# Altium schematic sheet [04]-PYTHON_FPGA_INTERFACE.SchDoc
size A4
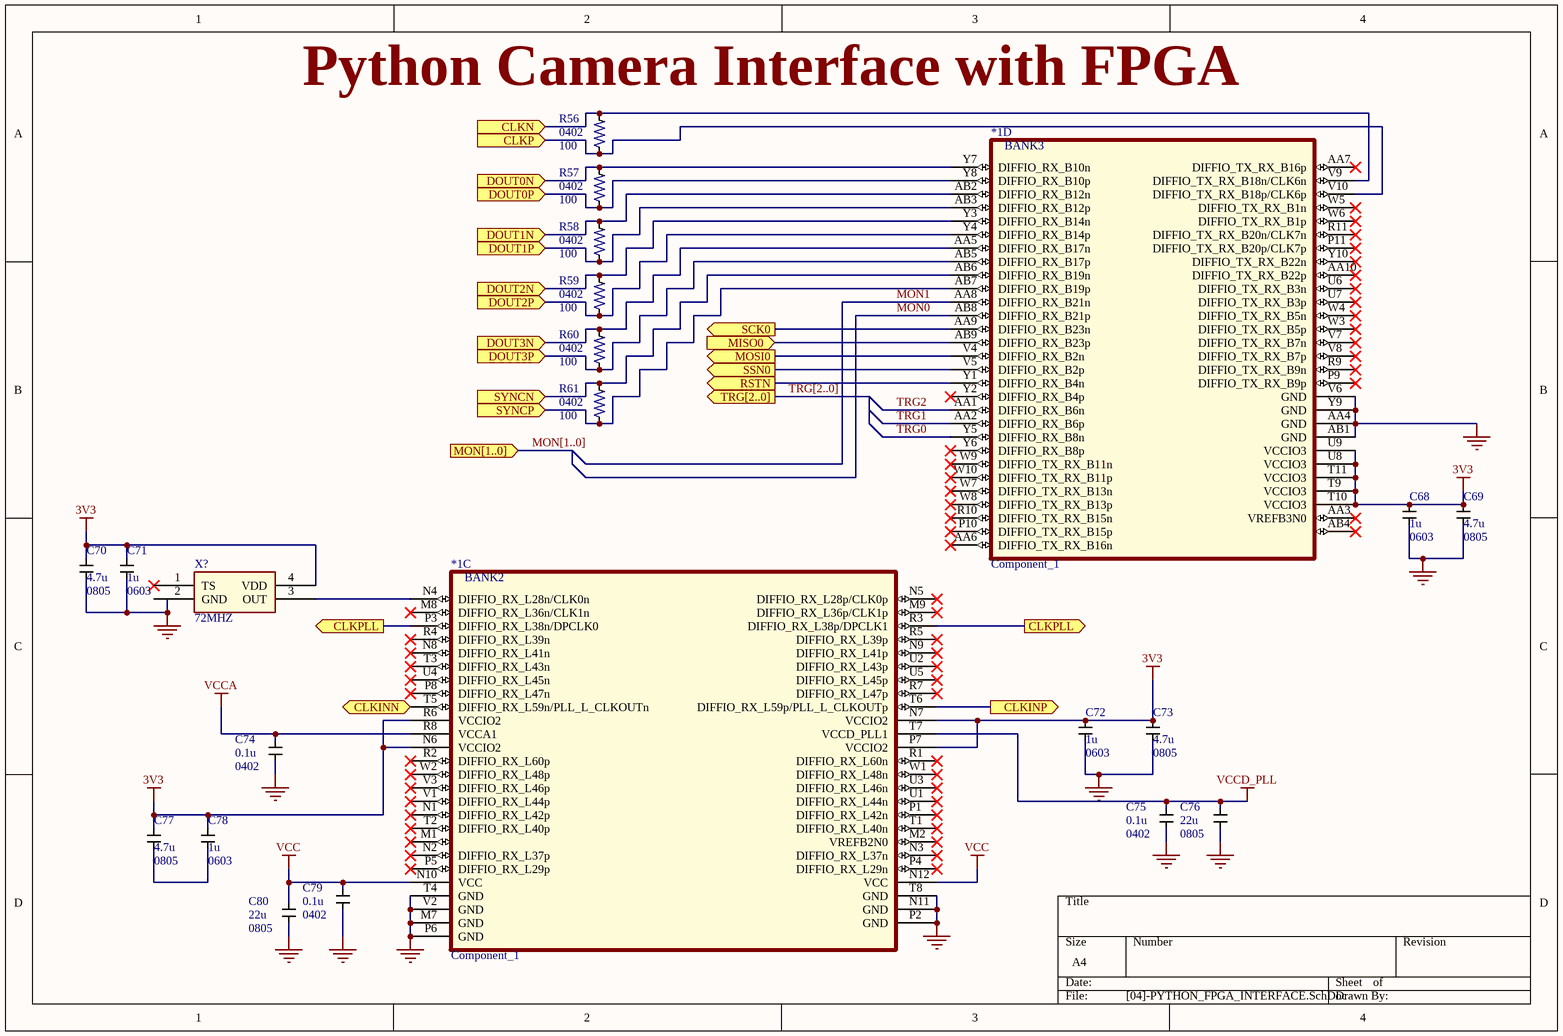
[diagram p0: [04]-PYTHON_FPGA_INTERFACE.SchDoc]

## Parts
*1  Component_1  [*BGA484N100P22X22_2300X2300X350]  (parts C,D of 9)
C68  1u  PCB Layer:: 0603  [*0603]
C69  4.7u  PCB Package: 0805  [*CAPC2013X140N]
C70  4.7u  PCB Package: 0805  [*CAPC2013X140N]
C71  1u  PCB Layer:: 0603  [*0603]
C72  1u  PCB Layer:: 0603  [*0603]
C73  4.7u  PCB Package: 0805  [*CAPC2013X140N]
C74  0.1u  PCB footprint: 0402
C75  0.1u  PCB footprint: 0402
C76  22u  PCB footprint: 0805
C77  4.7u  PCB Package: 0805  [*CAPC2013X140N]
C78  1u  PCB Layer:: 0603  [*0603]
C79  0.1u  PCB footprint: 0402
C80  22u  PCB footprint: 0805
R56  100  foot print: 0402  [*RESC1608X50N]
R57  100  foot print: 0402  [*RESC1608X50N]
R58  100  foot print: 0402  [*RESC1608X50N]
R59  100  foot print: 0402  [*RESC1608X50N]
R60  100  foot print: 0402  [*RESC1608X50N]
R61  100  foot print: 0402  [*RESC1608X50N]
X?  72MHZ  [OSC_DSC6083CI2A-032K768]

## Ports
CLKINN (out), CLKINP (out), CLKN (in), CLKP (in), CLKPLL (out), DOUT0N (in), DOUT0P (in), DOUT1N (in), DOUT1P (in), DOUT2N (in), DOUT2P (in), DOUT3N (in), DOUT3P (in), MISO0 (in), MON[1..0] (in), MOSI0 (out), RSTN (out), SCK0 (out), SSN0 (out), SYNCN (in), SYNCP (in), TRG[2..0] (out)

## Nets
3V3: *1.N6(VCCIO2) *1.N7(VCCIO2) *1.P7(VCCIO2) *1.R6(VCCIO2) *1.T9(VCCIO3) *1.T10(VCCIO3) *1.T11(VCCIO3) *1.U8(VCCIO3) *1.U9(VCCIO3) C68.2 C69.2 C70.2 C71.2 C72.2 C73.2 C77.2 C78.2 X?.4(VDD)
GND: *1.AA4(GND) *1.AB1(GND) *1.M7(GND) *1.N11(GND) *1.P2(GND) *1.P6(GND) *1.T4(GND) *1.T8(GND) *1.V2(GND) *1.V6(GND) *1.Y9(GND) C68.1 C69.1 C70.1 C71.1 C72.1 C73.1 C74.1 C75.1 C76.1 C79.1 C80.1 X?.2(GND)
VCC: *1.N10(VCC) *1.N12(VCC) C79.2 C80.2
VCCA: *1.R8(VCCA1) C74.2
VCCD_PLL: *1.T7(VCCD_PLL1) C75.2 C76.2
CLKINN: *1.T5(DIFFIO_RX_L59n/PLL_L_CLKOUTn) ; port CLKINN
CLKINP: *1.T6(DIFFIO_RX_L59p/PLL_L_CLKOUTp) ; port CLKINP
CLKN: *1.V9(DIFFIO_TX_RX_B18n/CLK6n) R56.2 ; port CLKN
CLKP: *1.V10(DIFFIO_TX_RX_B18p/CLK6p) R56.1 ; port CLKP
CLKPLL: *1.P3(DIFFIO_RX_L38n/DPCLK0) *1.R3(DIFFIO_RX_L38p/DPCLK1) ; port CLKPLL
DOUT0N: *1.Y7(DIFFIO_RX_B10n) R57.2 ; port DOUT0N
DOUT0P: *1.Y8(DIFFIO_RX_B10p) R57.1 ; port DOUT0P
DOUT1N: *1.AB2(DIFFIO_RX_B12n) R58.2 ; port DOUT1N
DOUT1P: *1.AB3(DIFFIO_RX_B12p) R58.1 ; port DOUT1P
DOUT2N: *1.Y3(DIFFIO_RX_B14n) R59.2 ; port DOUT2N
DOUT2P: *1.Y4(DIFFIO_RX_B14p) R59.1 ; port DOUT2P
DOUT3N: *1.AA5(DIFFIO_RX_B17n) R60.2 ; port DOUT3N
DOUT3P: *1.AB5(DIFFIO_RX_B17p) R60.1 ; port DOUT3P
MISO0: *1.AB9(DIFFIO_RX_B23p) ; port MISO0
MON0: *1.AB8(DIFFIO_RX_B21p)
MON1: *1.AA8(DIFFIO_RX_B21n)
MOSI0: *1.V4(DIFFIO_RX_B2n) ; port MOSI0
RSTN: *1.Y1(DIFFIO_RX_B4n) ; port RSTN
SCK0: *1.AA9(DIFFIO_RX_B23n) ; port SCK0
SSN0: *1.V5(DIFFIO_RX_B2p) ; port SSN0
SYNCN: *1.AB6(DIFFIO_RX_B19n) R61.2 ; port SYNCN
SYNCP: *1.AB7(DIFFIO_RX_B19p) R61.1 ; port SYNCP
TRG0: *1.Y5(DIFFIO_RX_B8n)
TRG1: *1.AA2(DIFFIO_RX_B6p)
TRG2: *1.AA1(DIFFIO_RX_B6n)
Net*1_N4: *1.N4(DIFFIO_RX_L28n/CLK0n) X?.3(OUT)
NetC77_1: C77.1 C78.1

Not connected (* = marked no-connect by the designer): *1 AA3(VREFB3N0)* AA6(DIFFIO_TX_RX_B16n)* AA7(DIFFIO_TX_RX_B16p)* AA10(DIFFIO_TX_RX_B22p)* AB4* M1* M2(VREFB2N0)* M8(DIFFIO_RX_L36n/CLK1n)* M9(DIFFIO_RX_L36p/CLK1p)* N1(DIFFIO_RX_L42p)* N2(DIFFIO_RX_L37p)* N3(DIFFIO_RX_L37n)* N5(DIFFIO_RX_L28p/CLK0p)* N8(DIFFIO_RX_L41n)* N9(DIFFIO_RX_L41p)* P1(DIFFIO_RX_L42n)* P4(DIFFIO_RX_L29n)* P5(DIFFIO_RX_L29p)* P8(DIFFIO_RX_L47n)* P9(DIFFIO_TX_RX_B9p)* P10(DIFFIO_TX_RX_B15p)* P11(DIFFIO_TX_RX_B20p/CLK7p)* R1(DIFFIO_RX_L60n)* R2(DIFFIO_RX_L60p)* R4(DIFFIO_RX_L39n)* R5(DIFFIO_RX_L39p)* R7(DIFFIO_RX_L47p)* R9(DIFFIO_TX_RX_B9n)* R10(DIFFIO_TX_RX_B15n)* R11(DIFFIO_TX_RX_B20n/CLK7n)* T1(DIFFIO_RX_L40n)* T2(DIFFIO_RX_L40p)* T3(DIFFIO_RX_L43n)* U1(DIFFIO_RX_L44n)* U2(DIFFIO_RX_L43p)* U3(DIFFIO_RX_L46n)* U4(DIFFIO_RX_L45n)* U5(DIFFIO_RX_L45p)* U6(DIFFIO_TX_RX_B3n)* U7(DIFFIO_TX_RX_B3p)* V1(DIFFIO_RX_L44p)* V3(DIFFIO_RX_L46p)* V7(DIFFIO_TX_RX_B7n)* V8(DIFFIO_TX_RX_B7p)* W1(DIFFIO_RX_L48n)* W2(DIFFIO_RX_L48p)* W3(DIFFIO_TX_RX_B5p)* W4(DIFFIO_TX_RX_B5n)* W5(DIFFIO_TX_RX_B1n)* W6(DIFFIO_TX_RX_B1p)* W7(DIFFIO_TX_RX_B13n)* W8(DIFFIO_TX_RX_B13p)* W9(DIFFIO_TX_RX_B11n)* W10(DIFFIO_TX_RX_B11p)* Y2(DIFFIO_RX_B4p)* Y6(DIFFIO_RX_B8p)* Y10(DIFFIO_TX_RX_B22n)*; X? 1(TS)*

## Buses and harness runs
bus MON[1..0] = port MON[1..0]
bus TRG[2..0] = port TRG[2..0]

## Notes on the sheet
- (near R56) Python Camera Interface with FPGA
- (in symbol Component_1, part C) BANK2
- (in symbol Component_1, part D) BANK3

## Library data of the parts
C68-C80 = Component_1
  C68 C71 C72 C78: Buying URL:: https://uk.farnell.com/avx/0603yc105kat2a/cap-1-f-16v-10-x7r-0603/dp/1658870RL?st=1u%200603
  C69 C70 C73 C77: Buying URL:: https://uk.farnell.com/avx/08053d475kat2a/cap-4-7-f-25v-10-x5r-0805/dp/1657932?st=4.7u%200805
  C74-C76 C79 C80: Buying URL:: NEED TO BE ADDED
R56-R61 = RP73D1J76R8BTDG: Res Thin Film 0603 76.8 Ohm 0.1% 1/10W Â±15ppm/Â°C Molded SMD Paper T/R; MF: TE Connectivity / Holsworthy; Design by: Faheem; Price: None; MP: RP73D1J76R8BTDG; Package: 0603 TE Connectivity / AMP; SnapEDA_Link: https://www.snapeda.com/parts/RP73D1J76R8BTDG/TE%20Connectivity%20/%20Holsworthy/view-part/?ref=snap; Value: *; Buying URL:: https://uk.farnell.com/vishay/crcw0402100rfked/res-100r-1-0-063w-0402-thick-film/dp/1469672RL; Availability: Unavailable
X? = Component_1: mf_part no.: DSC1001CL5-040.0000; Manufactured by: MICROCHIP